# EasyEDA Pro project STM32G431RBT6_development_PCB.epro

# Board PCB1
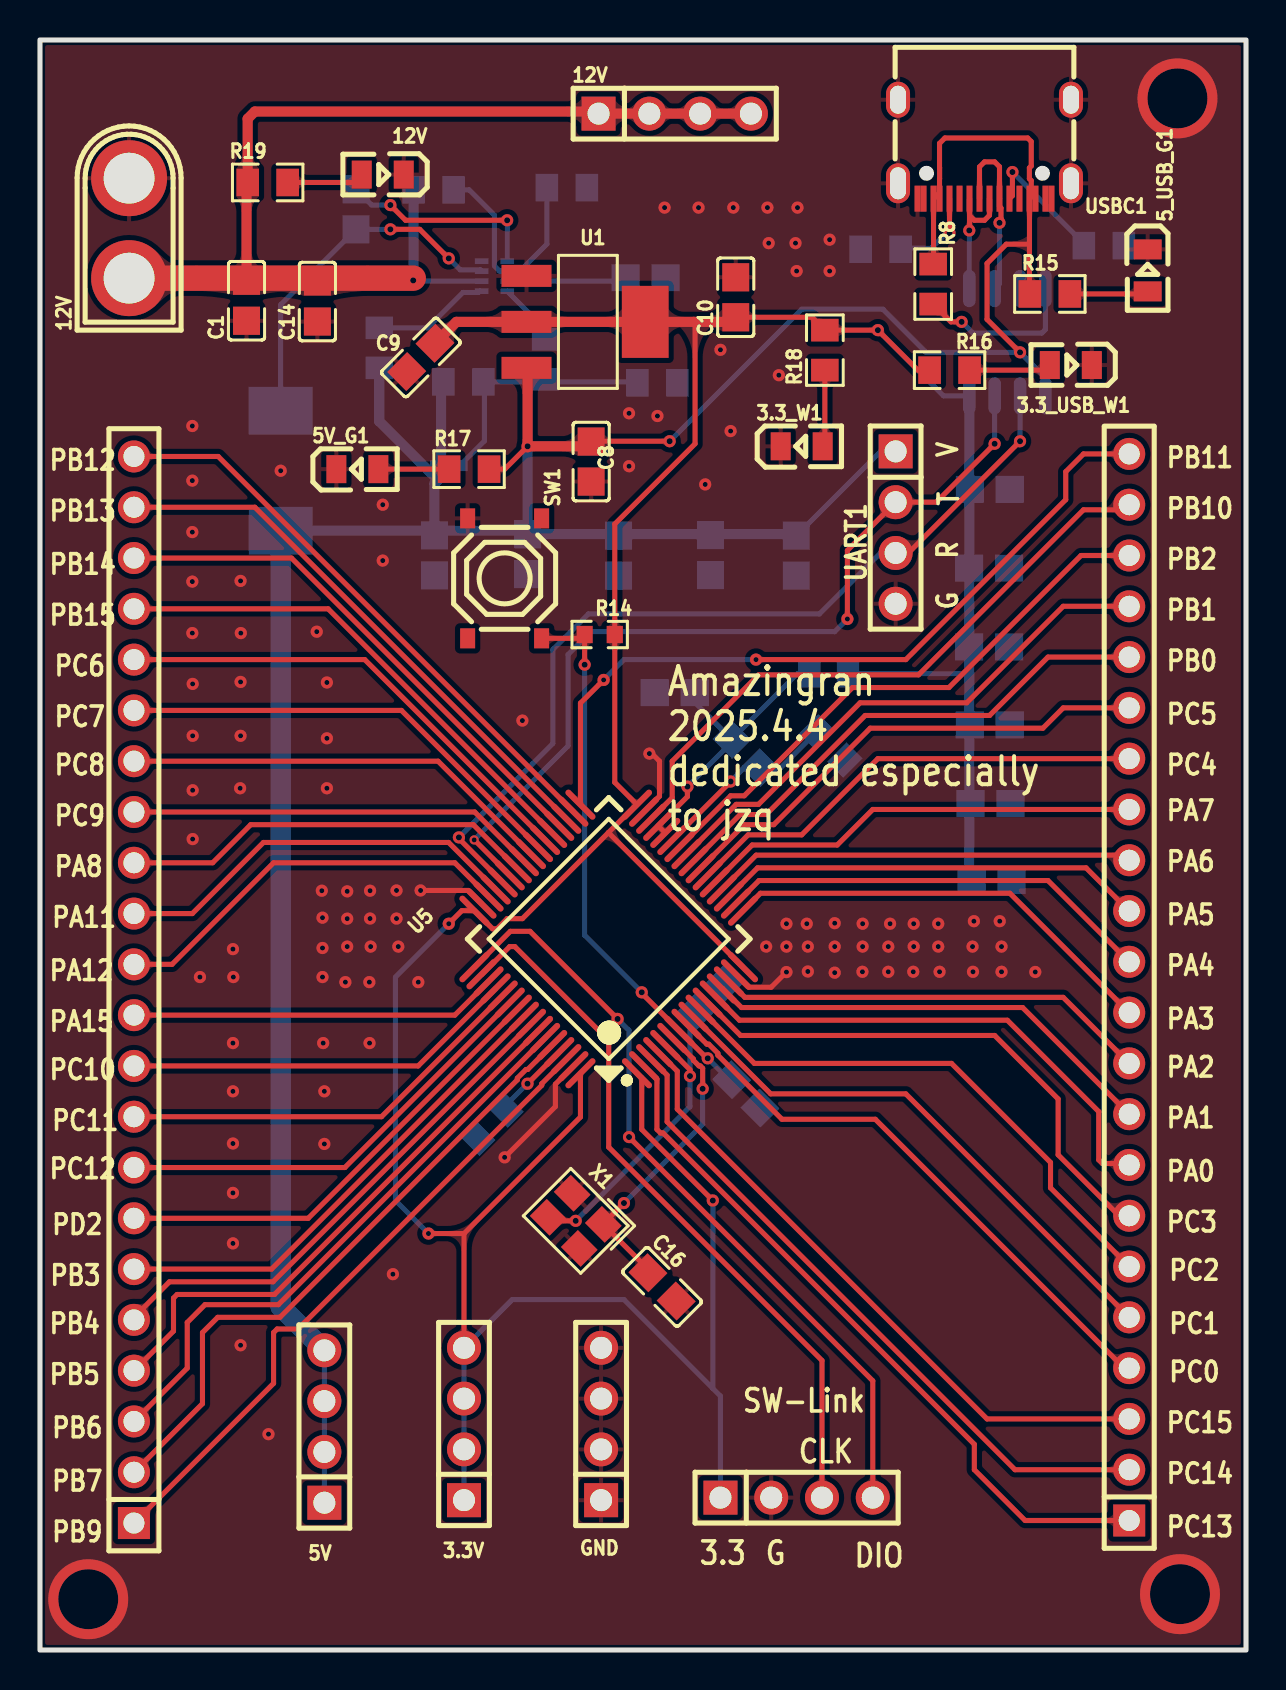
[diagram p0: board, top side]
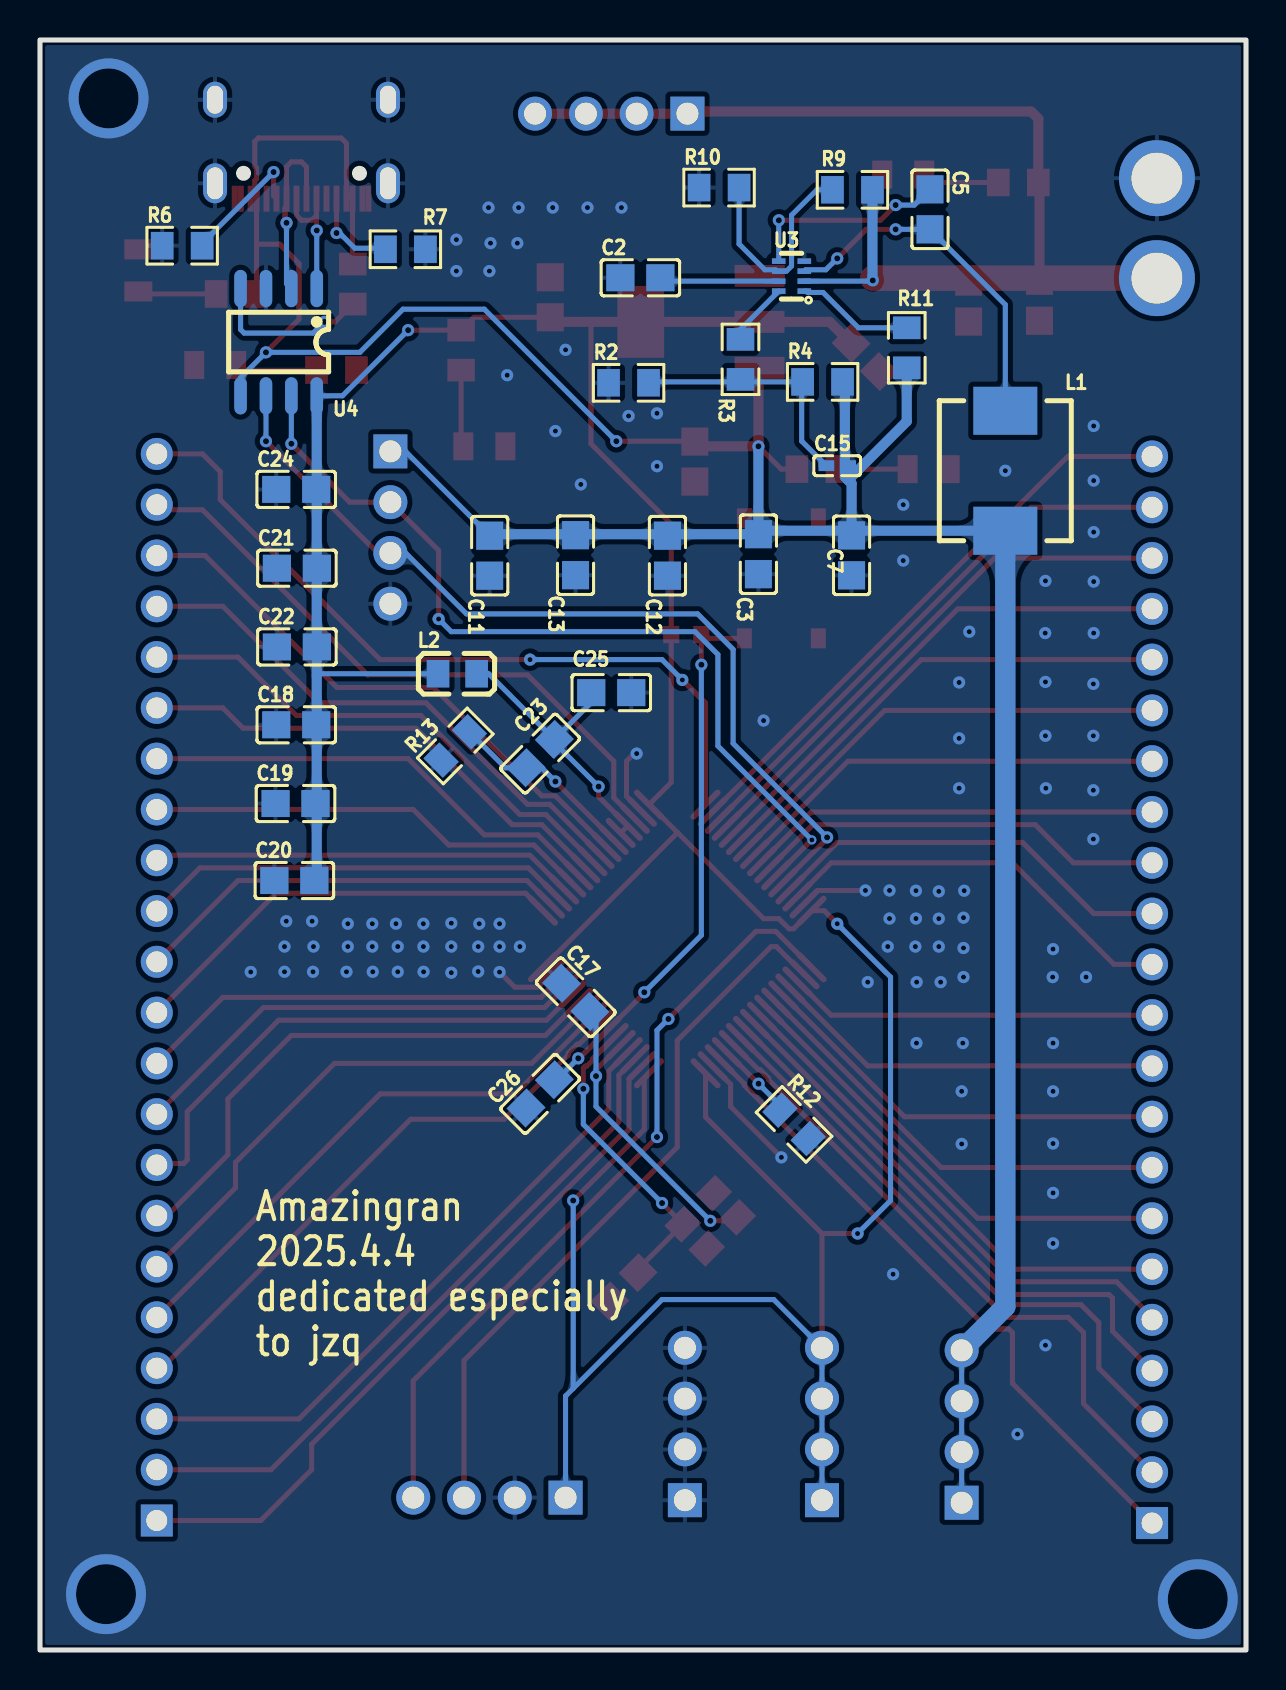
[diagram p1: board, bottom side, seen from below]

Outline 60.32 x 80.52 mm; copper layers: Top Layer, Bottom Layer. Coordinates in mm from the lower left corner of the outline.
Outline path: rectangle 0,80.52 60.32,0
Stack: Top Layer 0.035mm / Dielectric1 1.51mm FR4 er 4.5 / Bottom Layer 0.035mm

## Design rules (mm)
template: 自定义配置
spacing copperThickness1oz (default): track to track 0.051, other pairs 0.051 to 0.3
spacing copperThickness2oz: track to track 0.051, other pairs 0.051 to 0.3
track width copperThickness1oz (default): min 0.127, default 0.254, max 2.54
track width copperThickness2oz: min 0.203, default 0.254, max 2.54
differential pair differentialPair (default): width min 0.127, default 0.254, max 2.54; gap min 0.152, default 0.152
via viaSize (default): diameter min 0.457, default 0.61, max 10; hole min 0.254, default 0.305, max 6.299

## Placement (name value [footprint] x y rotation side)
3.3_USB_W1  NCD0805R1  [LED0805-R-RD]  51.56 64.26 180 top
3.3_W1  NCD0805R1  [LED0805-R-RD]  38.1 60.2 0 top
3.3V  3.3V  [HDR-TH_4P-P2.54-V-M]  21.21 11.3 90 top
5_USB_G1  NCD0805R1  [LED0805-R-RD]  55.41 69 270 top
5V  5V  [HDR-TH_4P-P2.54-V-M]  14.22 11.18 90 top
5V_G1  NCD0805R1  [LED0805-R-RD]  15.88 59.06 0 top
12V  -  [LED0805-R-RD]  17.15 73.79 180 top
12V#2  -  [HDR-TH_4P-P2.54-V-M]  31.75 76.84 0 top
12V#3  -  [CONN-TH_XT30U-M]  4.46 71.11 90 top
C1  22uF  [C0805]  10.33 67.48 90 top
C2  22nF  [C0805]  30.29 68.63 180 bottom
C3  22uF  [C0805]  24.39 54.8 90 bottom
C5  100nF  [C0805]  15.81 72.05 270 bottom
C7  22uF  [C0805]  19.73 54.75 270 bottom
C8  10uF  [C0805]  27.57 59.43 90 top
C9  10uF  [C0805]  19.05 64.64 225 top
C10  10uF  [C0805]  34.8 67.65 90 top
C11  10uF  [C0805]  37.83 54.73 90 bottom
C12  10uF  [C0805]  28.94 54.73 90 bottom
C13  100nF  [C0805]  33.54 54.75 270 bottom
C14  100nF  [C0805]  13.88 67.44 90 top
C15  300pF  [C0402]  20.45 59.23 180 bottom
C16  6.8pF  [C0805]  31.12 18.16 315 top
C17  6.8pF  [C0805]  33.53 32.64 225 bottom
C18  100nF  [C0805]  47.51 46.27 180 bottom
C19  100nF  [C0805]  47.54 42.33 180 bottom
C20  100nF  [C0805]  47.6 38.48 180 bottom
C21  100nF  [C0805]  47.47 54.1 180 bottom
C22  100nF  [C0805]  47.47 50.17 180 bottom
C23  100nF  [C0805]  35.31 44.83 135 bottom
C24  100nF  [C0805]  47.51 58.04 180 bottom
C25  1uF  [C0805]  31.75 47.88 0 bottom
C26  100nF  [C0805]  35.31 27.81 135 bottom
GND  GND  [HDR-TH_4P-P2.54-V-M]  28.07 11.3 90 top
H1  DAPLINK  [HDR-TH_4P-P2.54-V-M]  37.85 7.62 0 top
H7  1 - 32  [HDR-TH_22P-P2.54-V-M]  54.48 33.15 90 top
H8  33 - 64  [HDR-TH_22P-P2.54-V-M]  4.7 33.02 90 top
L1  6.8uH  [IND-SMD_L7.0-W6.6]  12.04 58.98 270 bottom
L2  470nH  [L0805]  39.45 48.82 180 bottom
R2  10kΩ  [R0805]  30.88 63.37 180 bottom
R3  10kΩ  [R0805]  25.29 64.55 90 bottom
R4  90.9kΩ  [R0805]  21.18 63.42 180 bottom
R6  5kΩ  [R0805]  53.21 70.23 180 bottom
R7  5kΩ  [R0805]  42.05 70.05 180 bottom
R8  4.7kΩ  [R0805]  44.68 68.31 270 top
R9  191kΩ  [R0805]  19.69 73.03 0 bottom
R10  50kΩ  [R0805]  26.36 73.14 180 bottom
R11  10kΩ  [R0805]  16.97 65.12 90 bottom
R12  10kΩ  [R0805]  22.61 26.29 225 bottom
R13  10kΩ  [R0805]  39.55 45.21 135 bottom
R14  10kΩ  [R0603]  28 50.78 180 top
R15  10kΩ  [R0805]  50.51 67.82 180 top
R16  10kΩ  [R0805]  45.5 64.01 180 top
R17  10kΩ  [R0805]  21.46 59.06 0 top
R18  10kΩ  [R0805]  39.26 65.01 90 top
R19  90.9kΩ  [R0805]  11.39 73.39 180 top
SW1  RESET  [SW-SMD_4P-L5.1-W5.1-P3.70-LS6.5-TL_H1.5]  23.24 53.59 270 top
U1  AMS1117-3.3  [SOT-223-3_L6.5-W3.4-P2.30-LS7.0-BR]  27.31 66.42 180 top
U3  MP2338GTL-Z  [SOT-583-8_L2.1-W1.2-P0.50-LS1.6-BR]  22.73 68.71 180 bottom
U4  CH340N  [SOP-8_L4.9-W3.9-P1.27-LS6.0-BL]  48.39 65.41 0 bottom
U5  STM32G431RBT6  [LQFP-64_L10.0-W10.0-P0.50-LS12.0-BL]  28.45 35.56 45 top
USBC1  TYPE-C-31-M-12  [USB-C_SMD-TYPE-C-31-M-12]  47.24 75.06 180 top
VTRG  UART1  [HDR-TH_4P-P2.54-V-M]  42.8 56.13 270 top
X1  24MHz  [CRYSTAL-SMD_4P-L3.2-W2.5-BL]  26.8 21.46 135 top

## Footprints (pads in the part's own frame, mm; a bottom-side part is the same pattern mirrored in y, then rotated)
C0402
  rect 0.79x0.54 smd: 1(-0.545,0) 2(0.545,0)
C0805
  rect 1.41x1.35 smd: 1(-1,0) 2(1,0)
CONN-TH_XT30U-M
  round 3.8 hole 2.54: 1(-2.5,0) 2(2.5,0)
CRYSTAL-SMD_4P-L3.2-W2.5-BL
  rect 1.4x1.2 smd: 1(-1.1,-0.85) 2(1.1,-0.85) 3(1.1,0.85) 4(-1.1,0.85)
HDR-TH_4P-P2.54-V-M
  rect 1.7x1.7 hole 1.1: 1(-3.81,0)
  round 1.7 hole 1.1: 2(-1.27,0) 3(1.27,0) 4(3.81,0)
HDR-TH_22P-P2.54-V-M
  rect 1.6x1.6 hole 1.05: 1(-26.67,0)
  round 1.6 hole 1.05: 2(-24.13,0) 3(-21.59,0) 4(-19.05,0) 5(-16.51,0) 6(-13.97,0) 7(-11.43,0) 8(-8.89,0) 9(-6.35,0) 10(-3.81,0) 11(-1.27,0) 12(1.27,0) 13(3.81,0) 14(6.35,0) 15(8.89,0) 16(11.43,0) 17(13.97,0) 18(16.51,0) 19(19.05,0) 20(21.59,0) 21(24.13,0) 22(26.67,0)
IND-SMD_L7.0-W6.6
  rect 2.4x3.2 smd: 1(-3,0) 2(3,0)
L0805
  rect 1.133x1.377 smd: 1(-0.966,0) 2(0.966,0)
LED0805-R-RD
  rect 1x1.399 smd: 1(1.05,0) 2(-1.05,0)
LQFP-64_L10.0-W10.0-P0.50-LS12.0-BL
  oval 0.3x2 smd: 1(-3.75,-5.75) 2(-3.25,-5.75) 3(-2.75,-5.75) 4(-2.25,-5.75) 5(-1.75,-5.75) 6(-1.25,-5.75) 7(-0.75,-5.75) 8(-0.25,-5.75) 9(0.25,-5.75) 10(0.75,-5.75) 11(1.25,-5.75) 12(1.75,-5.75) 13(2.25,-5.75) 14(2.75,-5.75) 15(3.25,-5.75) 16(3.75,-5.75) 33(3.75,5.75) 34(3.25,5.75) 35(2.75,5.75) 36(2.25,5.75) 37(1.75,5.75) 38(1.25,5.75) 39(0.75,5.75) 40(0.25,5.75) 41(-0.25,5.75) 42(-0.75,5.75) 43(-1.25,5.75) 44(-1.75,5.75) 45(-2.25,5.75) 46(-2.75,5.75) 47(-3.25,5.75) 48(-3.75,5.75)
  oval 2x0.3 smd: 17(5.75,-3.75) 18(5.75,-3.25) 19(5.75,-2.75) 20(5.75,-2.25) 21(5.75,-1.75) 22(5.75,-1.25) 23(5.75,-0.75) 24(5.75,-0.25) 25(5.75,0.25) 26(5.75,0.75) 27(5.75,1.25) 28(5.75,1.75) 29(5.75,2.25) 30(5.75,2.75) 31(5.75,3.25) 32(5.75,3.75) 49(-5.75,3.75) 50(-5.75,3.25) 51(-5.75,2.75) 52(-5.75,2.25) 53(-5.75,1.75) 54(-5.75,1.25) 55(-5.75,0.75) 56(-5.75,0.25) 57(-5.75,-0.25) 58(-5.75,-0.75) 59(-5.75,-1.25) 60(-5.75,-1.75) 61(-5.75,-2.25) 62(-5.75,-2.75) 63(-5.75,-3.25) 64(-5.75,-3.75)
R0603
  rect 0.806x0.864 smd: 1(-0.753,0) 2(0.753,0)
R0805
  rect 1.133x1.377 smd: 1(-1,0) 2(1,0)
SOP-8_L4.9-W3.9-P1.27-LS6.0-BL
  oval 0.63x1.865 smd: 1(-1.905,-2.683) 2(-0.635,-2.683) 3(0.635,-2.683) 4(1.905,-2.683) 5(1.905,2.683) 6(0.635,2.683) 7(-0.635,2.683) 8(-1.905,2.683)
SOT-223-3_L6.5-W3.4-P2.30-LS7.0-BR
  rect 2.5x1.1 smd: 1(2.97,-2.3) 2(2.97,0) 3(2.97,2.3)
  rect 2.34x3.6 smd: 4(-2.97,0)
SOT-583-8_L2.1-W1.2-P0.50-LS1.6-BR
  rect 0.68x0.28 smd: 1(0.64,-0.75) 2(0.64,-0.25) 3(0.64,0.25) 4(0.64,0.75) 5(-0.64,0.75) 6(-0.64,0.25) 7(-0.64,-0.25) 8(-0.64,-0.75)
SW-SMD_4P-L5.1-W5.1-P3.70-LS6.5-TL_H1.5
  rect 1x0.75 smd: 1(-3,1.85) 2(3,1.85) 3(-3,-1.85) 4(3,-1.85)
USB-C_SMD-TYPE-C-31-M-12
  oval 1.2x2 hole 0.8x1.6: 0(-4.325,1.706) 1(4.325,1.706)
  oval 1.2x1.8 hole 0.8x1.4: 2(4.325,-2.474) 3(-4.325,-2.474)
  rect 0.3x1.3 smd: A1(-3.35,2.474) A4(-2.55,2.474) A5(-1.25,2.474) A6(-0.25,2.474) A7(0.25,2.474) A8(1.25,2.474) A9(2.55,2.474) A12(3.35,2.474) B1(3.05,2.474) B4(2.25,2.474) B5(1.75,2.474) B6(0.75,2.474) B7(-0.75,2.474) B8(-1.75,2.474) B9(-2.25,2.474) B12(-3.05,2.474)

## Nets
3.3V: 3.3V.1 3.3V.2 3.3V.3 3.3V.4 C9.1 C10.1 C18.2 C19.2 C20.2 C21.2 C22.2 C24.2 H1.1 L2.1 R14.1 R16.2 R18.2 U1.2 U1.4 U4.8 U5.1 U5.16 U5.32 U5.48 U5.64
5V: 5V.1 5V.2 5V.3 5V.4 C3.2 C7.1 C8.2 C11.2 C12.2 C13.1 C15.2 L1.2 R4.2 R8.1 R11.1 R15.2 R17.2 U1.3 U4.5 USBC1.A4 USBC1.A9 USBC1.B4 USBC1.B9 VTRG.1
12V: 12V#2.1 12V#2.2 12V#2.3 12V#2.4 12V#3.1 C1.2 C14.2 R9.1 R19.2 U3.2
GND: 3.3_USB_W1.2 3.3_W1.2 5_USB_G1.2 5V_G1.2 12V.2 12V#3.2 C1.1 C2.1 C3.1 C7.2 C8.1 C9.2 C10.2 C11.1 C12.1 C13.2 C14.1 C16.2 C17.1 C18.1 C19.1 C20.1 C21.1 C22.1 C24.1 C25.1 C26.1 GND.1 GND.2 GND.3 GND.4 H1.2 R2.1 R6.1 R7.2 R10.1 R12.2 R13.1 SW1.3 U1.1 U3.4 U4.3 U5.15 U5.31 U5.47 U5.63 USBC1.0 USBC1.1 USBC1.2 USBC1.3 USBC1.A1 USBC1.A12 USBC1.B1 USBC1.B12 VTRG.4 X1.2 X1.4
VDDA: C23.2 C25.2 L2.2 U5.28 U5.29
VSSA: C23.1 R13.2 U5.27
BOOT0: R12.1 U5.61
NRST: C26.2 R14.2 SW1.2 U5.7
OSC_IN: C17.2 U5.5 X1.3
OSC_OUT: C16.1 U5.6 X1.1
PA0: H7.8 U5.12
PA1: H7.9 U5.13
PA2: H7.10 U5.14
PA3: H7.11 U5.17
PA4: H7.12 U5.18
PA5: H7.13 U5.19
PA6: H7.14 U5.20
PA7: H7.15 U5.21
PA8: H8.14 U5.42
PA11: H8.13 U5.45
PA12: H8.12 U5.46
PA15: H8.11 U5.51
PB0: H7.18 U5.24
PB1: H7.19 U5.25
PB2: H7.20 U5.26
PB3: H8.6 U5.56
PB4: H8.5 U5.57
PB5: H8.4 U5.58
PB6: H8.3 U5.59
PB7: H8.2 U5.60
PB9: H8.1 U5.62
PB10: H7.21 U5.30
PB11: H7.22 U5.33
PB12: H8.22 U5.34
PB13: H8.21 U5.35
PB14: H8.20 U5.36
PB15: H8.19 U5.37
PC0: H7.4 U5.8
PC1: H7.5 U5.9
PC2: H7.6 U5.10
PC3: H7.7 U5.11
PC4: H7.16 U5.22
PC5: H7.17 U5.23
PC6: H8.18 U5.38
PC7: H8.17 U5.39
PC8: H8.16 U5.40
PC9: H8.15 U5.41
PC10: H8.10 U5.52
PC11: H8.9 U5.53
PC12: H8.8 U5.54
PC13: H7.1 U5.2
PC14: H7.2 U5.3
PC15: H7.3 U5.4
PD2: H8.7 U5.55
RTS#UEN: R8.2 U4.4
SWCLK: H1.3 U5.50
SWDIO: H1.4 U5.49
UART_RX: U4.6 U5.44 VTRG.3
UART_TX: U4.7 U5.43 VTRG.2
USB-DN: U4.2 USBC1.A7 USBC1.B7
USB-DP: U4.1 USBC1.A6 USBC1.B6
$2N1614: C15.1 R2.2 R3.1 R4.1
$2N1636: C2.2 U3.7
$2N1642: R11.2 U3.1
$2N1643: C5.2 L1.1 U3.3
$2N1648: C5.1 U3.5
$2N1649: R9.2 R10.2 U3.6
$2N1650: R3.2 U3.8
$2N1686: R7.1 USBC1.B5
$2N1687: R6.2 USBC1.A5
$2N2912: 3.3_W1.1 R18.1
$2N2917: 5V_G1.1 R17.1
$2N2938: 5_USB_G1.1 R15.1
$2N2943: 3.3_USB_W1.1 R16.1
$2N3056: 12V.1 R19.1

Pads without a net: SW1 1 4; USBC1 A8 B8

## Via types
v1: diameter 0.61, hole 0.305, Top Layer to Bottom Layer, 30 vias
v2: diameter 0.61, hole 0.254, Top Layer to Bottom Layer, 107 vias
v3: diameter 4, hole 3, Top Layer to Bottom Layer, 3 vias
v4: diameter 0.457, hole 0.254, Top Layer to Bottom Layer, 1 via

## Routing (per net, layer and track width the routed paths; a pad name or vN(x,y) marks a point on that pad's centre or on a via; arc(x,y) is an arc through that point)
3.3V: length 192.2
  Top Layer w0.254: 21.21,20.83 3.3V.4 ; 21.21,20.83 v2(19.43,20.83) ; 21.21,20.83 27.03,26.65 U5.64 ; v2(20.45,36.32) 21.1,36.97 21.73,36.97 22.64,36.07 22.86,36.07 23.37,36.58 24.13,36.58 28.43,40.87 ; U5.16 28.44,40.87 28.43,40.87 ; C10.1 38.62,66.65 R18.2 v1(41.91,66.01) 43.91,64.01 R16.2 ; v1(33.66,22.48) 30.1,26.03 30.1,28.61 U5.1 ; 28.43,40.87 29.83,42.28 U5.32 28.75,43.39 R14.1 28.75,56.31 32.77,60.33 32.77,66.36 32.7,66.42
  Top Layer w0.508: C10.1 34.57,66.42 U1.4 U1.2 20.83,66.42 19.76,65.35
  Bottom Layer w0.254: 3.3V.1 3.3V.2 3.3V.3 3.3V.4 23.62,17.53 29.21,17.53 33.66,13.08 ; 33.66,13.08 34.04,12.7 H1.1 ; 33.66,13.08 v1(33.66,22.48) ; U4.8 45.2,62.72 v1(41.91,66.01) ; L2.1 46.37,48.82 46.48,48.71 ; v2(19.43,20.83) 17.78,22.48 17.78,33.66 v2(20.45,36.32)
  Bottom Layer w0.508: U4.8 46.48,38.6 C20.2
5V: length 165.3
  Top Layer w0.254: R8.1 44.69,69.33 USBC1.A9 44.99,72.88 ; USBC1.A4 49.58,72.79 49.58,73.49 49.49,73.58 49.49,74.12 49.58,74.22 49.58,75.44 49.4,75.62 45.26,75.62 44.99,75.35 44.99,74.13 45,74.12 45,73.58 44.99,73.58 44.99,72.88 ; 44.99,72.88 USBC1.B4 ; USBC1.B9 49.49,70.31 ; 49.49,70.31 49.49,67.84 R15.2 ; 49.49,70.31 48.34,70.31 47.37,69.34 47.37,66.55 v1(49.02,64.9) ; v1(24.39,60.2) 23.25,59.06 R17.2 ; v1(31.5,60.45) 27.59,60.45
  Top Layer w0.508: C8.2 27.33,60.2 v1(24.39,60.2) 24.39,64.07 U1.3
  Bottom Layer w0.254: C11.2 42.05,59.94 VTRG.1 ; 5V.4 5V.3 5V.2 5V.1 ; v1(31.5,60.45) 38.1,67.06 42.16,67.06 44.32,64.9 v1(49.02,64.9) 50.29,63.63 U4.5
  Bottom Layer w0.508: C3.2 v1(24.39,60.2) ; C3.2 37.76,55.8 C11.2 ; C3.2 24.22,55.98 19.73,55.98 ; 19.73,55.98 19.73,58.34 19.9,58.51 ; 19.73,55.98 C7.1 ; 19.73,55.98 L1.2 ; R4.2 20.07,63.31 20.07,58.67 19.9,58.51 ; 19.9,58.51 16.97,61.45 R11.1
  Bottom Layer w1.016: L1.2 12.04,17.17 5V.4
12V: length 55.7
  Top Layer w0.254: C1.2 10.33,68.61
  Top Layer w0.508: 12V#2.4 12V#2.3 12V#2.2 12V#2.1 27.84,76.94 10.75,76.94 10.39,76.58 R19.2 10.33,73.34 10.33,68.61
  Top Layer w1.27: 18.67,68.61 12V#3.1
  Bottom Layer w0.254: v1(18.67,68.49) 18.71,68.46 22.09,68.46
  Bottom Layer w0.508: R9.1 18.69,68.51 v1(18.67,68.49)
GND: length 15.9
  Top Layer w0.254: v2(37.34,33.9) 37.33,33.9 36.58,33.15 35.46,33.15 U5.15 ; U5.63 25.78,28.3 25.78,27.18 v2(23.24,24.64) ; U5.47 21.43,37.98 v2(19.04,37.98) ; v2(30.48,44.83) 30.61,44.83 30.99,44.45 30.99,42.7 30.22,41.92
  vias: v2(7.62,61.21) v2(7.62,58.48) v2(7.62,55.91) v2(7.62,53.43) v2(7.62,50.86) v2(7.64,48.31) v2(7.64,45.72) v2(7.64,43) v2(7.64,40.56) v2(8,33.66) v2(9.65,35.05) v2(9.67,33.66) v2(9.65,30.35) v2(9.65,27.94) v2(9.65,25.33) v2(9.65,22.86) v2(9.65,20.34) v2(10.01,43.1) v2(10.03,53.47) v2(10.04,50.86) v2(10.03,48.42) v2(10.03,45.72) v2(10.03,15.24) v2(11.43,10.79) v2(12.04,58.98) v2(13.84,50.93) v2(14.1,37.97) v2(14.13,36.62) v2(14.13,35.11) v2(14.13,33.66) v2(14.17,30.35) v2(14.22,27.94) v2(14.22,25.31) v2(14.35,48.39) v2(14.35,45.59) v2(14.35,43.1) v2(15.28,33.4) v2(15.37,37.94) v2(15.37,36.58) v2(15.37,35.18) v2(16.51,37.97) v2(16.51,36.58) v2(16.48,33.4) v2(16.48,30.35) v2(16.54,35.18) v2(17.15,57.28) v2(17.15,54.48) v2(17.65,18.8) v2(17.83,37.98) v2(17.83,36.58) v2(17.92,35.18) v2(18.92,33.4) v2(24.13,46.48) v2(29.46,61.85) v2(29.46,59.2) v2(30.88,61.71) v2(31.24,72.14) v2(32.94,72.14) v2(33.27,58.29) v2(34.04,65.02) v2(34.54,60.96) v2(34.68,72.14) v2(36.32,35.18) v2(36.39,72.14) v2(36.45,70.36) v2(36.96,63.75) v2(37.34,36.32) v2(37.34,35.18) v2(37.79,70.36) v2(37.89,72.14) v2(37.85,68.96) v2(38.35,36.32) v2(38.41,35.18) v2(38.41,33.93) v2(39.5,70.53) v2(39.5,68.96) v2(39.75,36.35) v2(39.75,35.18) v2(39.75,33.87) v2(41.15,36.32) v2(41.15,35.18) v2(41.14,33.92) v2(42.52,36.32) v2(42.43,35.18) v2(42.43,33.92) v2(43.7,36.32) v2(43.7,35.18) v2(43.68,33.92) v2(44.93,36.32) v2(44.93,35.18) v2(45,33.92) v2(46.71,36.45) v2(46.65,35.18) v2(46.67,33.92) v2(48.01,36.45) v2(48.1,35.18) v2(48.1,33.92) v2(49.78,33.91) v3(2.41,2.54) v3(56.9,77.6) v3(57.02,2.79)
VDDA: length 14.7
  Top Layer w0.254: U5.28 30.92,41.22 32.38,42.68 v1(32.38,43.18)
  Bottom Layer w0.254: v1(32.38,43.18) 34.6,45.39 34.6,45.54 ; 34.6,45.54 32.75,47.39 C25.2 ; 34.6,45.54 37.89,48.82 L2.2
VSSA: length 9.5
  Top Layer w0.254: U5.27 34.54,43.42 v1(34.54,43.43)
  Bottom Layer w0.254: v1(34.54,43.43) 35.23,44.12 37.05,44.12 38.85,45.92
BOOT0: length 4
  Top Layer w0.254: 25.97,29.9 24.39,28.32 v1(24.38,28.32)
  Bottom Layer w0.254: 23.31,27 23.31,27.25 v1(24.38,28.32)
NRST: length 27.6
  Top Layer w0.254: v1(30.1,32.89) 30.1,32.85 33.36,29.59 v1(33.4,29.59) ; v1(27.24,49.28) R14.2 27.05,50.59 25.09,50.59
  Bottom Layer w0.254: 34.6,28.52 34.47,28.52 v1(33.4,29.59) ; v1(27.24,49.28) 27.24,35.75 v1(30.1,32.89)
OSC_IN: length 16.5
  Top Layer w0.254: U5.5 32.51,29.02 v1(32.51,28.7) ; 25.42,21.64 25.59,21.46 v1(26.8,21.46)
  Bottom Layer w0.254: 32.82,31.93 32.51,31.62 v1(32.51,28.7) 32.51,27.18 v1(26.8,21.46)
OSC_OUT: length 15.4
  Top Layer w0.254: v1(33.15,28.07) 33.15,29.09 33.03,29.21 32.96,29.21 32.68,29.49 32.68,29.56 U5.6 ; v1(29.21,22.35) 28.18,21.32 28.18,21.29 30.41,19.05 C16.1
  Bottom Layer w0.254: v1(33.15,28.07) 33.15,26.29 v1(29.21,22.35)
PA0: length 25.7
  Top Layer w0.254: 33.75,32.73 34.99,31.5 48.39,31.5 52.96,26.92 52.96,24.51 53.14,24.33 54.41,24.33 H7.8
PA1: length 23
  Top Layer w0.254: H7.9 49.15,32.13 35.09,32.13 34.13,33.09 U5.13
PA2: length 21.7
  Top Layer w0.254: U5.14 35.26,32.64 51.18,32.64 H7.10
PA3: length 22.2
  Top Layer w0.254: 35.17,36.97 36.04,37.85 48.51,37.85 H7.11
PA4: length 21.8
  Top Layer w0.254: U5.18 35.97,38.48 50.42,38.48 H7.12
PA5: length 21.5
  Top Layer w0.254: U5.19 35.89,39.12 52.32,39.12 H7.13
PA6: length 21.2
  Top Layer w0.254: U5.20 35.82,39.75 54.23,39.75 H7.14
PA7: length 22.2
  Top Layer w0.254: H7.15 41.66,42.04 39.88,40.26 35.62,40.26 U5.21
PA8: length 20.8
  Top Layer w0.254: U5.42 21.67,41.28 10.54,41.28 8.64,39.37 H8.14
PA11: length 20.5
  Top Layer w0.254: U5.45 20.44,40.39 11.18,40.39 7.62,36.83 H8.13
PA12: length 20.5
  Top Layer w0.254: U5.46 20.75,39.37 11.68,39.37 6.6,34.29 H8.12
PA15: length 18.4
  Top Layer w0.254: H8.11 20.75,31.75 U5.51
PB0: length 26
  Top Layer w0.254: H7.18 50.42,49.66 47.5,46.74 41.28,46.74 36.32,41.78 35.02,41.78 U5.24
PB1: length 27.3
  Top Layer w0.254: H7.19 51.18,52.2 46.35,47.37 41.02,47.37 35.94,42.29 34.83,42.29 32.34,39.8
PB2: length 28.5
  Top Layer w0.254: H7.20 52.07,54.74 45.47,48.13 40.64,48.13 35.23,42.72 34.55,42.72 U5.26
PB3: length 24.7
  Top Layer w0.254: U5.56 11.58,19.05 H8.6
PB4: length 26.1
  Top Layer w0.254: 24.56,31.32 11.66,18.42 6.48,18.42 4.7,16.64 H8.5
PB5: length 28.2
  Top Layer w0.254: H8.4 6.68,15.95 6.68,17.6 6.86,17.78 11.73,17.78 24.91,30.96
PB6: length 29.9
  Top Layer w0.254: H8.3 7.37,14.1 7.37,16.38 8.25,17.27 11.93,17.27 U5.59
PB7: length 31.9
  Top Layer w0.254: H8.2 8.13,12.32 8.13,15.88 8.89,16.64 12,16.64 23.88,28.51 23.88,28.6 24.31,29.03 24.4,29.03 U5.60
PB9: length 32.8
  Top Layer w0.254: H8.1 11.68,13.34 11.68,15.88 11.86,16.05 12.91,16.05 25.1,28.24 25.1,28.32 26.33,29.55
PB10: length 31.5
  Top Layer w0.254: H7.21 54.23,57.02 52.2,57.02 43.94,48.77 35.94,48.77 31.62,44.45 31.62,42.62 30.57,41.57
PB11: length 38.5
  Top Layer w0.254: H7.22 52.2,59.82 51.31,58.93 51.31,57.53 43.31,49.53 v2(35.81,49.53) ; U5.33 27.03,47.35 v2(28.19,48.51)
  Bottom Layer w0.254: v2(35.81,49.53) 29.21,49.53 v2(28.19,48.51)
PB12: length 29.3
  Top Layer w0.254: 26.68,41.92 8.91,59.69 H8.22
PB13: length 28.1
  Top Layer w0.254: 26.33,41.57 10.75,57.15 H8.21
PB14: length 26.8
  Top Layer w0.254: H8.20 12.58,54.61 25.97,41.22
PB15: length 25.6
  Top Layer w0.254: U5.37 14.41,52.07 H8.19
PC0: length 29.3
  Top Layer w0.254: H7.4 54.23,14.1 41.78,26.54 37.11,26.54 33.91,29.75 33.91,29.84 33.45,30.3 33.36,30.3 32.34,31.32
PC1: length 28
  Top Layer w0.254: H7.5 43.31,27.81 36.55,27.81 U5.9
PC2: length 27.5
  Top Layer w0.254: H7.6 50.55,23.11 50.55,24.38 45.59,29.34 35.73,29.34 U5.10
PC3: length 27.1
  Top Layer w0.254: 33.4,32.38 35.04,30.73 47.75,30.73 50.93,27.56 50.93,24.77 53.97,21.72 H7.7
PC4: length 23.5
  Top Layer w0.254: U5.22 35.42,40.77 38.1,40.77 41.91,44.58 H7.16
PC5: length 24.8
  Top Layer w0.254: H7.17 51.18,47.12 50.16,46.1 41.53,46.1 36.7,41.28 35.22,41.28 U5.23
PC6: length 24.3
  Top Layer w0.254: H8.18 16.25,49.53 U5.38
PC7: length 23
  Top Layer w0.254: H8.17 18.08,46.99 U5.39
PC8: length 21.8
  Top Layer w0.254: 24.56,39.8 19.91,44.45 H8.16
PC9: length 20.5
  Top Layer w0.254: U5.41 21.74,41.91 H8.15
PC10: length 19.7
  Top Layer w0.254: U5.52 18.92,29.21 H8.10
PC11: length 21
  Top Layer w0.254: 23.15,32.73 17.08,26.67 H8.9
PC12: length 22.2
  Top Layer w0.254: 23.5,32.38 15.25,24.13 H8.8
PC13: length 35.9
  Top Layer w0.254: U5.2 30.86,28.55 30.86,26.03 31.04,25.86 31.17,25.86 46.74,10.29 46.74,9.02 49.28,6.48 H7.1
PC14: length 33.8
  Top Layer w0.254: H7.2 48.77,9.02 31.37,26.42 31.37,28.75 30.57,29.55
PC15: length 32.3
  Top Layer w0.254: 30.92,29.9 31.88,28.95 31.88,27.05 47.37,11.56 H7.3
PD2: length 23.5
  Top Layer w0.254: H8.7 13.42,21.59 U5.55
RTS#UEN: length 8.3
  Top Layer w0.254: v1(46.1,66.42) 45.57,66.42 R8.2
  Bottom Layer w0.254: U4.4 50.29,66.04 50.11,65.86 46.66,65.86 v1(46.1,66.42)
SWCLK: length 36.2
  Top Layer w0.254: H1.3 39.12,14.48 28.45,25.15 28.45,30.48 23.75,35.18 23.5,35.18 22.11,33.79 U5.50
SWDIO: length 38.9
  Top Layer w0.254: U5.49 23.53,35.94 24.51,35.94 v1(28.89,31.56) ; v1(29.46,25.65) 41.66,13.46 H1.4
  Bottom Layer w0.254: v1(29.46,25.65) 29.46,30.99 v1(28.89,31.56)
UART_RX: length 44.5
  Top Layer w0.254: v1(49.02,60.45) 43.43,54.86 VTRG.3 ; U5.44 20.96,40.58 v1(20.96,40.64)
  Bottom Layer w0.254: v1(49.02,60.45) U4.6 ; VTRG.3 42.04,54.86 38.99,51.82 27.43,51.82 25.65,50.04 25.65,45.34 v1(20.96,40.64)
UART_TX: length 43.8
  Top Layer w0.254: v4(21.72,40.51) 21.73,40.51 U5.43 ; v2(40.39,51.56) 40.39,54.99 VTRG.2 44.83,57.4 v1(47.75,60.33)
  Bottom Layer w0.254: v4(21.72,40.51) 26.42,45.21 26.42,49.78 27.56,50.93 39.75,50.93 v2(40.39,51.56) ; v1(47.75,60.33) U4.7
USB-DN: length 9
  Top Layer w0.254: USBC1.A7 46.99,74.17 47.24,74.42 47.75,74.42 47.99,74.18 USBC1.B7 47.99,72.19 48.07,72.11 48.07,71.6 47.99,71.52 v1(47.99,71.37)
  Bottom Layer w0.254: v1(47.99,71.37) 47.99,68.33 U4.2
USB-DP: length 6.5
  Top Layer w0.254: 46.49,71.74 46.74,71.5 47.24,71.5 47.49,71.75 USBC1.A6 ; 46.49,71.74 46.49,71 v1(46.48,70.99) ; 46.49,71.74 USBC1.B6
  Bottom Layer w0.254: v1(46.48,70.99) U4.1
$2N1614: length 12.4
  Bottom Layer w0.254: C15.1 22.22,60.46 22.22,63.37 R4.1 29.84,63.42 R2.2
$2N1636: length 6
  Bottom Layer w0.254: C2.2 29.12,68.46 U3.7
$2N1642: length 5.9
  Bottom Layer w0.254: R11.2 19.39,66.12 21.15,67.89 21.93,67.89 22,67.96 22.09,67.96
$2N1643: length 17.8
  Top Layer w0.254: v1(20.45,69.6) 18.99,71.05 v1(17.53,71.05)
  Bottom Layer w0.254: 22.09,68.96 22.03,69.02 21.02,69.02 v1(20.45,69.6) ; v1(17.53,71.05) C5.2 12.04,67.28 L1.1
$2N1648: length 10.2
  Top Layer w0.254: v1(17.53,72.26) 18.29,71.5 v1(23.37,71.5)
  Bottom Layer w0.254: v1(17.53,72.26) 16.59,72.26 C5.1 ; U3.5 23.37,71.5 v1(23.37,71.5)
$2N1649: length 11.2
  Bottom Layer w0.254: R10.2 25.36,70.31 24.07,69.02 23.54,69.02 23.47,68.96 U3.6 22.99,68.96 22.73,69.22 22.73,71.75 21.46,73.03 R9.2
$2N1650: length 3.2
  Bottom Layer w0.254: U3.8 25.29,66.04 R3.2
$2N1686: length 4.5
  Top Layer w0.254: USBC1.B5 v1(45.49,70.87)
  Bottom Layer w0.254: R7.1 43.1,70.1 44.58,70.1 45.34,70.87 v1(45.49,70.87)
$2N1687: length 6.6
  Top Layer w0.254: v1(48.64,73.91) 48.64,72.73 USBC1.A5
  Bottom Layer w0.254: v1(48.64,73.91) 52.21,70.34 R6.2
$2N2912: length 3.9
  Top Layer w0.254: 3.3_W1.1 39.26,60.31 R18.1
$2N2917: length 3.5
  Top Layer w0.254: R17.1 5V_G1.1
$2N2938: length 3.9
  Top Layer w0.254: 5_USB_G1.1 55.28,67.82 R15.1
$2N2943: length 4.1
  Top Layer w0.254: 3.3_USB_W1.1 50.26,64.01 R16.1
$2N3056: length 3.9
  Top Layer w0.254: R19.1 15.9,73.39 16.16,73.66

## Copper pours and planes (outline as drawn; the poured copper is in the pictures)
GND on Top Layer: 0,80.52 60.32,80.52 60.32,0 0,0
GND on Bottom Layer: 0,80.52 60.32,80.52 60.32,0 0,0

Small or netless copper shapes (teardrops, artwork), in the pictures only: 278 on Top Layer, 172 on Bottom Layer

## Text on the board
Bottom Silkscreen Layer: Amazingran / 2025.4.4 / dedicated especially / to jzq
Top Silkscreen Layer: PB12 | PB13 | PB14 | PB15 | PA12 | PA15 | PC10 | PC12 | PB4 | PB5 | PB3 | PA11 | PC11 | PD2 | PB6 | PB7 | PB9 | PC6 | PC7 | PC8 | PC9 | PA8 | PB11 | PB10 | PB2 | PB1 | PB0 | PC5 | PC4 | PA7 | PA6 | PA5 | PA4 | PA3 | PA2 | PA1 | PA0 | PC3 | PC15 | PC14 | PC13 | PC2 | PC1 | PC0 | V | R | G | T | UART1 | 3.3 | SW-Link | CLK | DIO | Amazingran / 2025.4.4 / dedicated especially / to jzq
